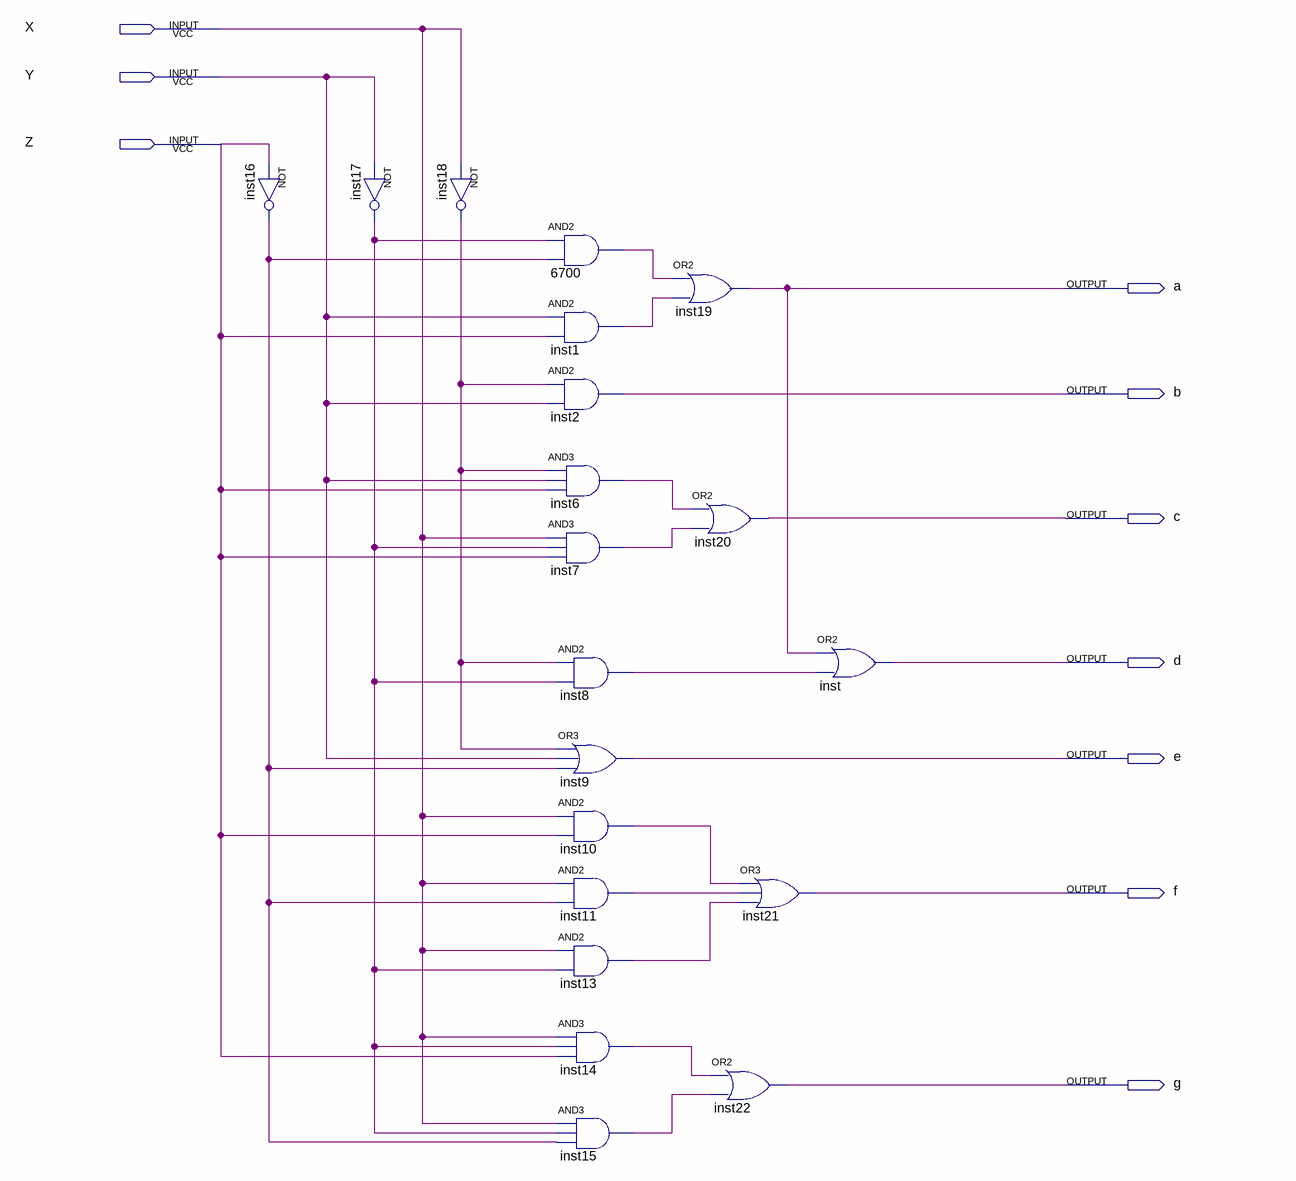
[diagram p0: schematic sheet]
// Quartus schematic Telephone.bdf as structural Verilog: 20 symbols, 10 pins
module Telephone (
  input  X,
  input  Y,
  input  Z,
  output a,
  output b,
  output c,
  output d,
  output e,
  output f,
  output g
);

  wire inst1_out, inst6_out, inst7_out, inst8_out, inst10_out, inst11_out, inst13_out, inst14_out,
       inst15_out, inst16_out, inst17_out, inst18_out, n6700_out;

  not inst16 (inst16_out, Z);
  not inst17 (inst17_out, Y);
  not inst18 (inst18_out, X);
  and u_6700 (n6700_out, inst17_out, inst16_out);
  and inst1 (inst1_out, Y, Z);
  and inst2 (b, inst18_out, Y);
  and inst6 (inst6_out, inst18_out, Y, Z);
  and inst7 (inst7_out, X, inst17_out, Z);
  and inst8 (inst8_out, inst18_out, inst17_out);
  or inst9 (e, inst18_out, Y, inst16_out);
  and inst10 (inst10_out, X, Z);
  and inst11 (inst11_out, X, inst16_out);
  and inst13 (inst13_out, X, inst17_out);
  and inst14 (inst14_out, X, inst17_out, Z);
  and inst15 (inst15_out, X, inst17_out, inst16_out);
  or inst19 (a, n6700_out, inst1_out);
  or inst20 (c, inst6_out, inst7_out);
  or inst21 (f, inst10_out, inst11_out, inst13_out);
  or inst22 (g, inst14_out, inst15_out);
  or inst (d, a, inst8_out);
endmodule
